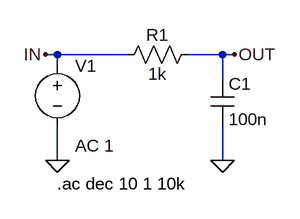
[diagram p0: schematic zad1_lista5.asc]
zad1_lista5.asc, the LTspice schematic file:
Version 4.1
SHEET 1 880 680
WIRE 32 80 16 80
WIRE 128 80 32 80
WIRE 256 80 208 80
WIRE 272 80 256 80
WIRE 32 96 32 80
WIRE 256 112 256 80
WIRE 32 224 32 176
WIRE 256 224 256 176
FLAG 256 224 0
FLAG 32 224 0
FLAG 272 80 OUT
FLAG 16 80 IN
SYMBOL res 224 64 R90
WINDOW 0 5 56 VBottom 2
WINDOW 3 27 56 VTop 2
SYMATTR InstName R1
SYMATTR Value 1k
SYMBOL voltage 32 80 R0
WINDOW 123 24 124 Left 2
WINDOW 39 0 0 Left 0
SYMATTR InstName V1
SYMATTR Value ""
SYMATTR Value2 AC 1
SYMBOL cap 240 112 R0
SYMATTR InstName C1
SYMATTR Value 100n
TEXT 32 256 Left 2 !.ac dec 10 1 10k

The netlist it stands for:
* zad1_lista5.asc
R1 OUT IN 1k
V1 IN 0 AC 1
C1 OUT 0 100n
.ac dec 10 1 10k
.backanno
.end